# Altium schematic sheet PAC.SchDoc
size A
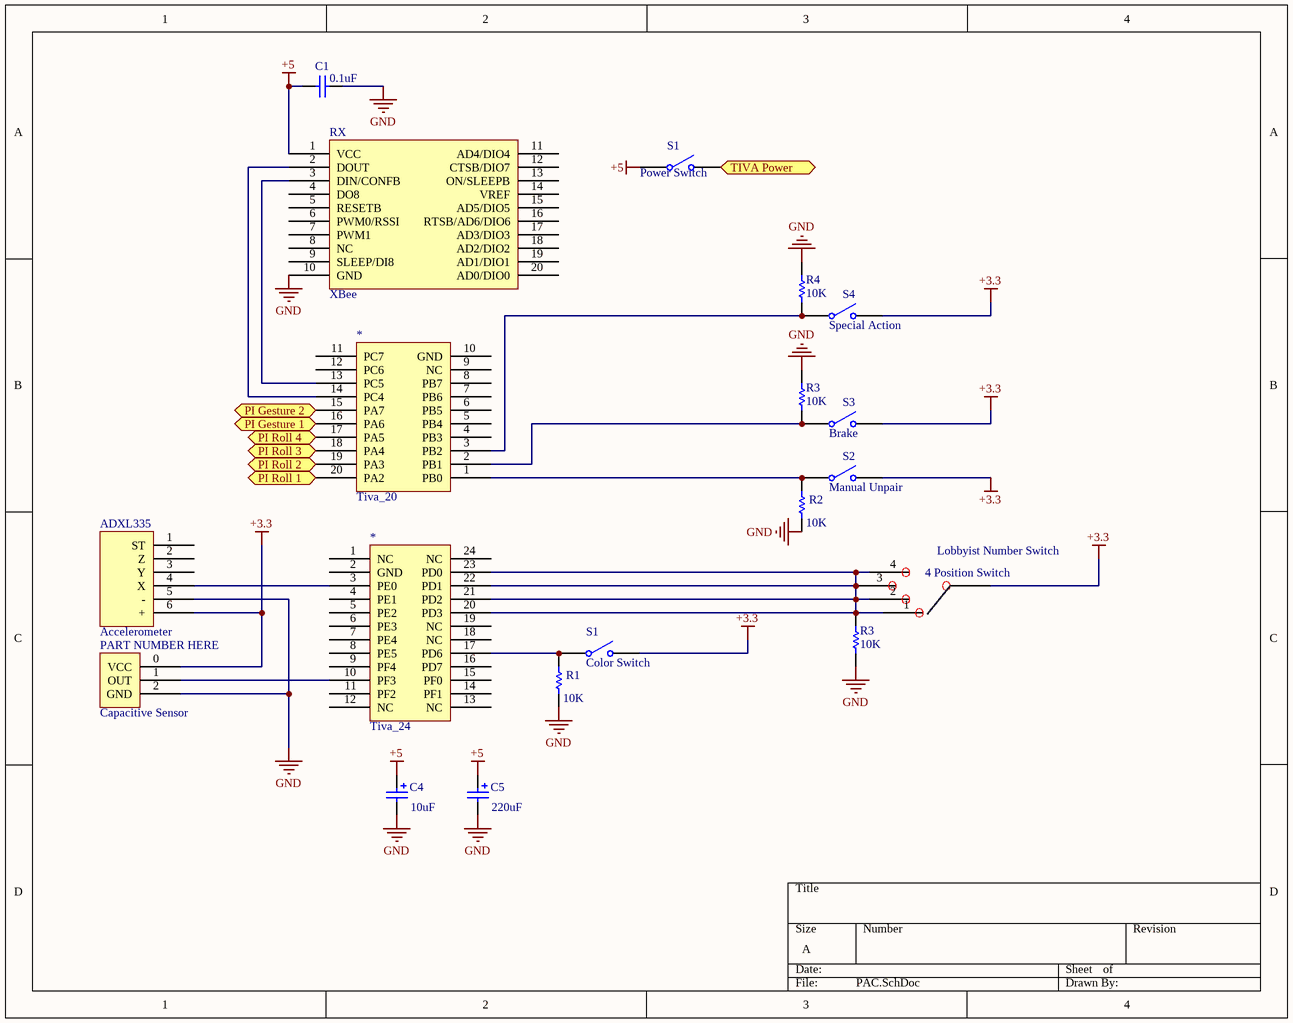
[diagram p0: PAC.SchDoc]

## Parts
(Parts that share a designator on the sheet are numbered #1, #2 ... from top to bottom, then left to right.)
*#1  Tiva_20
*#2  Tiva_24
ADXL335  Accelerometer
C1  value 0.1uF  [RAD-0.3]  (hidden comment: Cap)
C4  value 10uF  [RB7.6-15]  (hidden comment: Cap Pol1)
C5  value 220uF  [RB7.6-15]  (hidden comment: Cap Pol1)
Lobbyist_Number_Switch  4 Position Switch
PART_NUMBER_HERE  Capacitive Sensor
R1  value 10K  [AXIAL-0.3]  (hidden comment: Res1)
R2  value 10K  [AXIAL-0.3]  (hidden comment: Res1)
R3#1  value 10K  [AXIAL-0.3]  (hidden comment: Res1)
R3#2  value 10K  [AXIAL-0.3]  (hidden comment: Res1)
R4  value 10K  [AXIAL-0.3]  (hidden comment: Res1)
RX  XBee
S1#1  Power Switch  [SPST-2]
S1#2  Color Switch  [SPST-2]
S2  Manual Unpair  [SPST-2]
S3  Brake  [SPST-2]
S4  Special Action  [SPST-2]

## Ports
PI Gesture 1, PI Gesture 2, PI Roll 1, PI Roll 2, PI Roll 3, PI Roll 4, TIVA Power

## Nets
+3.3: ADXL335.6(+) PART_NUMBER_HERE.0(VCC) S1#2.2(NO) S2.2(NO) S3.2(NO) S4.2(NO)
+5: C1.1 C4.1 C5.1 RX.1(VCC) S1#1.1(COMMON)
GND: ADXL335.5(-) C1.2 C4.2 C5.2 PART_NUMBER_HERE.2(GND) R1.1 R2.1 R3#1.1 R3#2.1 R4.1 RX.10(GND)
PI Gesture 1: *#1.16(PA6) ; port PI Gesture 1
PI Gesture 2: *#1.15(PA7) ; port PI Gesture 2
PI Roll 1: *#1.20(PA2) ; port PI Roll 1
PI Roll 2: *#1.19(PA3) ; port PI Roll 2
PI Roll 3: *#1.18(PA4) ; port PI Roll 3
PI Roll 4: *#1.17(PA5) ; port PI Roll 4
TIVA Power: S1#1.2(NO) ; port TIVA Power
Net*#1_1: *#1.1(PB0) R2.2 S2.1(COMMON)
Net*#1_2: *#1.2(PB1) R3#1.2 S3.1(COMMON)
Net*#1_3: *#1.3(PB2) R4.2 S4.1(COMMON)
Net*#1_13: *#1.13(PC5) RX.3(DIN/CONFB)
Net*#1_14: *#1.14(PC4) RX.2(DOUT)
Net*#2_3: *#2.3(PE0) ADXL335.4(X)
Net*#2_10: *#2.10(PF3) PART_NUMBER_HERE.1(OUT)
Net*#2_17: *#2.17(PD6) R1.2 S1#2.1(COMMON)
Net*#2_20: *#2.20(PD3) *#2.21(PD2) *#2.22(PD1) *#2.23(PD0) Lobbyist_Number_Switch.1 Lobbyist_Number_Switch.2 Lobbyist_Number_Switch.3 Lobbyist_Number_Switch.4 R3#2.2

Not connected (* = marked no-connect by the designer): *#1 4(PB3) 5(PB4) 6(PB5) 7(PB6) 8(PB7) 9(NC) 10(GND) 11(PC7) 12(PC6); *#2 1(NC) 2(GND) 4(PE1) 5(PE2) 6(PE3) 7(PE4) 8(PE5) 9(PF4) 11(PF2) 12(NC) 13(NC) 14(PF1) 15(PF0) 16(PD7) 18(NC) 19(NC) 24(NC); ADXL335 1(ST) 2(Z) 3(Y); Lobbyist_Number_Switch 7; RX 4(DO8) 5(RESETB) 6(PWM0/RSSI) 7(PWM1) 8(NC) 9(SLEEP/DI8) 11(AD4/DIO4) 12(CTSB/DIO7) 13(ON/SLEEPB) 14(VREF) 15(AD5/DIO5) 16(RTSB/AD6/DIO6) 17(AD3/DIO3) 18(AD2/DIO2) 19(AD1/DIO1) 20(AD0/DIO0)

## Library data of the parts
*#1 = Tiva_20: Tiva Protection 20 Pin Connector
*#2 = Tiva_24: Tiva Protection 24 Pin Connector
C1 = Cap: Capacitor; Published: 8-Jun-2000; LatestRevisionDate: 17-Jul-2002; LatestRevisionNote: Re-released for DXP Platform.; PackageReference: RAD-0.3; Publisher: Altium Limited; PackageDescription: Radial Cap, Thru-Hole; 2 Leads; 0.3 in Pin Spacing
C4 C5 = Cap Pol1: Polarized Capacitor (Radial); Manufacturer: Generic Components; Class: Passive; Published: 08/06/2000; Publisher: Altium Hobart Technology Centre; SubClass: Capacitor
R1 R2 R3#1 R3#2 R4 = Res1: Resistor; Manufacturer: Generic Components; Class: Passive; Published: 08/06/2000; Publisher: Altium Hobart Technology Centre; SubClass: Resistor
S1#1 S1#2 S2-S4 = SW-SPST: Single-Pole, Single-Throw Switch; Manufacturer: Generic Components; Published: 1999